# EasyEDA Pro project ProProject_20240815-UR5-手部姿态控制板_2024-09-21.epro

# Schematic Schematic1
Create Date: 2024-08-15; Page Name: P1; Project Name: 20240815-UR5-手部姿态控制板; Schematic Name: Schematic1; Update Date: 2024-08-15; Company: 嘉立创EDA; Page Size: A4; Version: V1.0
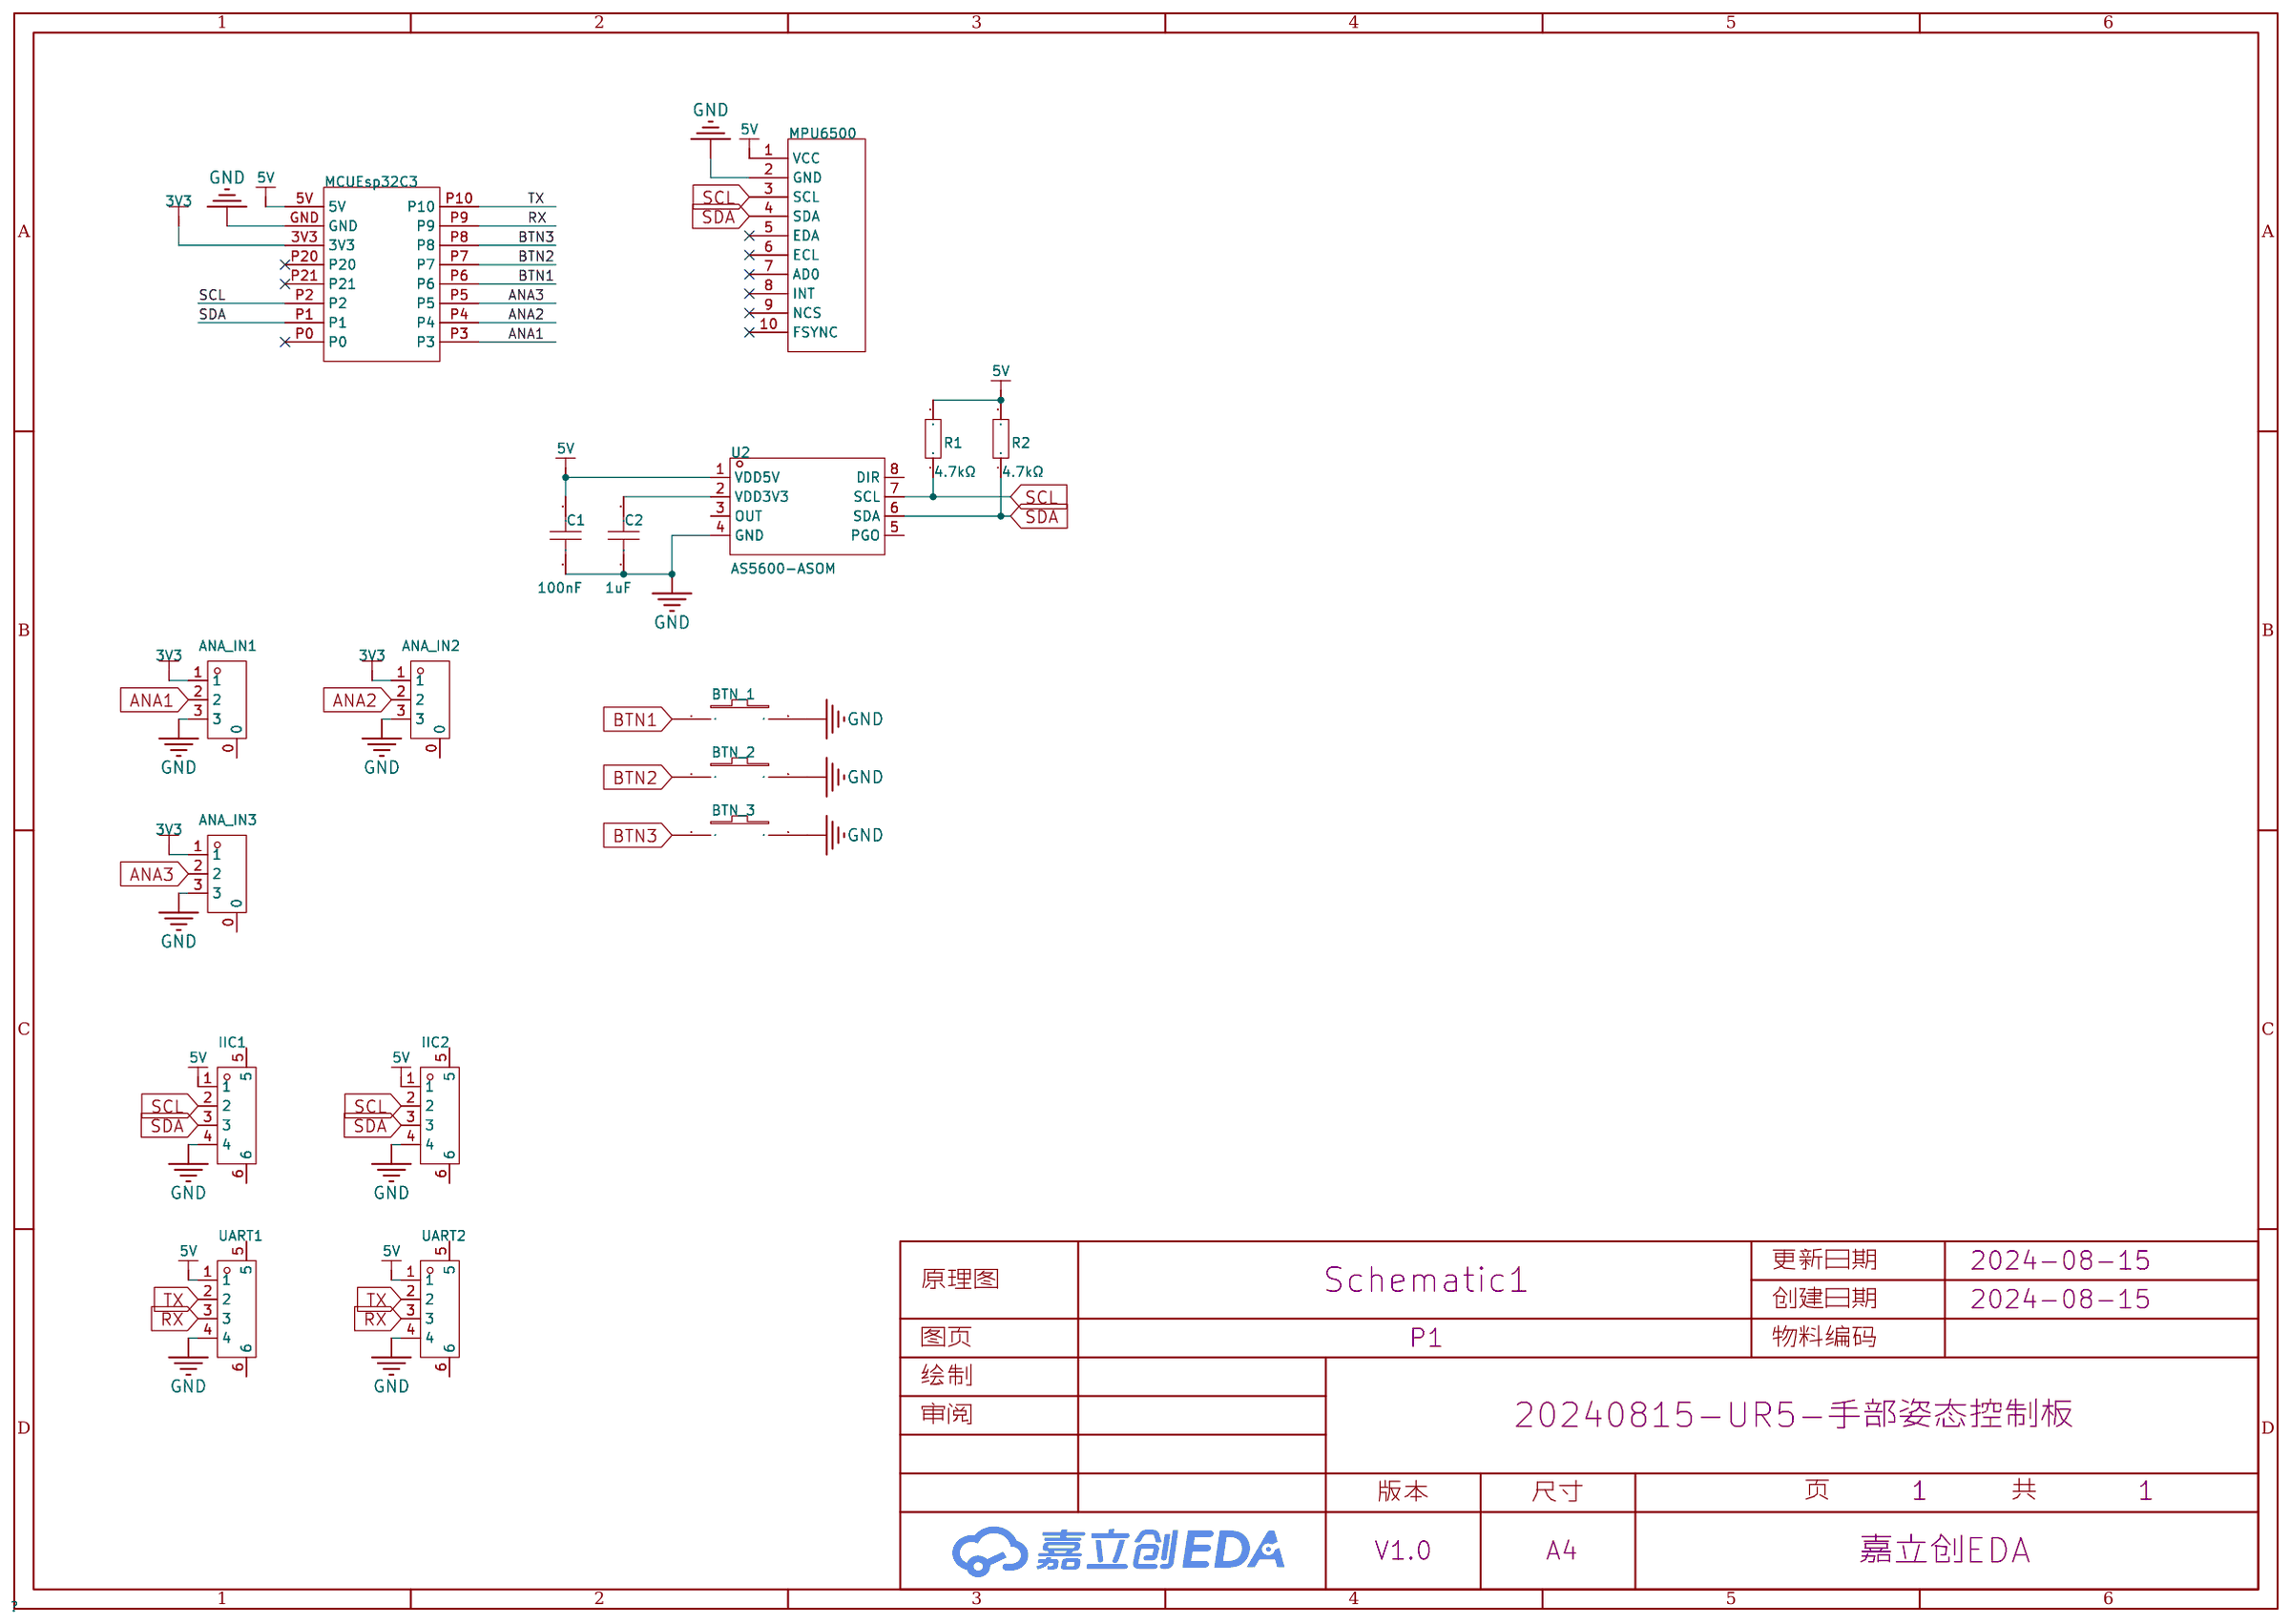
[diagram p0: schematic sheet]

## Parts
ANA_IN1  SH1.0-3P  [CONN-SMD_3P-P1.00-L5.0-W5.0]
ANA_IN2  SH1.0-3P  [CONN-SMD_3P-P1.00-L5.0-W5.0]
ANA_IN3  SH1.0-3P  [CONN-SMD_3P-P1.00-L5.0-W5.0]
BTN_1  K2-1104DZ-B4SW-04  [SW-TH_2P-L6.2-W6.2-P5.0]
BTN_2  K2-1104DZ-B4SW-04  [SW-TH_2P-L6.2-W6.2-P5.0]
BTN_3  K2-1104DZ-B4SW-04  [SW-TH_2P-L6.2-W6.2-P5.0]
C1  1uF  [C1206]
C2  1uF  [C1206]
IIC1  SH1.0 4P  [CONN-SMD_4P-P1.00_C9900013908]
IIC2  SH1.0 4P  [CONN-SMD_4P-P1.00_C9900013908]
MCUEsp32C3  -  [Esp32-C3-mini]
MPU6500  -  [6558模块]
R1  4.7kΩ  [R1206]
R2  4.7kΩ  [R1206]
U2  AS5600-ASOM  [SOIC-8_L5.0-W4.0-P1.27-LS6.0-BL]
UART1  SH1.0 4P  [CONN-SMD_4P-P1.00_C9900013908]
UART2  SH1.0 4P  [CONN-SMD_4P-P1.00_C9900013908]

## Library data of the parts
ANA_IN1-ANA_IN3 = SH1.0-3P: Supplier Part: C9900019066; JLCPCB Part Class: 扩展库; Supplier: LCSC
BTN_1-BTN_3 = K2-1104DZ-B4SW-04: 作用力:250gf;安装方式:直插;开关长度:6mm;开关宽度:6mm;开关高度:4.5mm;触点电流:50mA;额定电压(DC):12V;绝缘电阻:100MΩ;机械寿命:10万次;; LCSC Part Name: 6x6x4.5  两脚插件开关; Supplier Part: C2690025; Manufacturer: 韩国韩荣; Supplier Footprint: 插件; JLCPCB Part Class: 扩展库; Datasheet: https://atta.szlcsc.com/upload/public/pdf/source/20201126/C961736_4F85C6E6E5B3656D5DC7C0B00D034F4A.pdf; Supplier: LCSC; Operating Force: 250gf; Mounting Style: 直插; Switch Length: 6mm; Switch Width: 6mm; Switch Height: 4.5mm; Contact Current: 50mA; Voltage Rating (DC): 12V; Insulation Resistance: 100MΩ; Mechanical Life: 10万次; Operating Temperature: -25℃~+85℃
C1 C2 = CL31B105KBHNNNE: 容值:1uF;精度:±10%;额定电压:50V;材质(温度系数):X7R;; LCSC Part Name: 1uF ±10% 50V; Supplier Part: C1848; Manufacturer: SAMSUNG(三星); Supplier Footprint: 1206; JLCPCB Part Class: 基础库; Datasheet: https://atta.szlcsc.com/upload/public/pdf/source/20160218/1457707763339.pdf; Supplier: LCSC; Tolerance: ±10%; Voltage Rated: 50V; Temperature Coefficient: X7R
IIC1 IIC2 UART1 UART2 = SH1.0 4P: Supplier Part: C9900013908; Supplier Footprint: A100-4; JLCPCB Part Class: 扩展库; Supplier: LCSC
MCUEsp32C3 = Esp32-C3-mini
MPU6500 = MPU6500
R1 R2 = 1206W4F4701T5E: 电阻类型:厚膜电阻;阻值:4.7kΩ;精度:±1%;功率:250mW;最大工作电压:200V;温度系数:±100ppm/℃;; LCSC Part Name: 4.7kΩ ±1% 250mW 厚膜电阻; Supplier Part: C17936; Manufacturer: UNI-ROYAL(厚声); Supplier Footprint: 1206; JLCPCB Part Class: 基础库; Datasheet: https://atta.szlcsc.com/upload/public/pdf/source/20200306/C422600_1E6D84923E4A46A82E41ADD87F860B5C.pdf; Supplier: LCSC; Type: 厚膜电阻; Tolerance: ±1%; Power(Watts): 250mW; Overload Voltage (Max): 200V; Temperature Coefficient: ±100ppm/℃; Operating Temperature Range: -55℃~+155℃
U2 = AS5600-ASOM: 旋转角度范围:0°~360°;; Supplier Part: C79815; Manufacturer: ams(艾迈斯半导体); Supplier Footprint: SOIC-8; JLCPCB Part Class: 扩展库; Datasheet: https://atta.szlcsc.com/upload/public/pdf/source/20161027/1477535527192.pdf; Supplier: LCSC; Supply Voltage: 5V；3.3V; Rotation Angle: 0°~360°

## Nets
3V3: ANA_IN1.1 ANA_IN2.1 ANA_IN3.1 MCUEsp32C3.3V3
5V: C1.2 IIC1.1 IIC2.1 MCUEsp32C3.5V MPU6500.1(VCC) R1.2 R2.2 U2.1(VDD5V) UART1.1 UART2.1
GND: ANA_IN1.3 ANA_IN2.3 ANA_IN3.3 BTN_1.2 BTN_2.2 BTN_3.2 C1.1 C2.1 IIC1.4 IIC2.4 MCUEsp32C3.GND MPU6500.2(GND) U2.4(GND) UART1.4 UART2.4
ANA1: ANA_IN1.2 MCUEsp32C3.P3
ANA2: ANA_IN2.2 MCUEsp32C3.P4
ANA3: ANA_IN3.2 MCUEsp32C3.P5
BTN1: BTN_1.1 MCUEsp32C3.P6
BTN2: BTN_2.1 MCUEsp32C3.P7
BTN3: BTN_3.1 MCUEsp32C3.P8
RX: MCUEsp32C3.P9 UART1.3 UART2.3
SCL: IIC1.2 IIC2.2 MCUEsp32C3.P2 MPU6500.3(SCL) R1.1 U2.7(SCL)
SDA: IIC1.3 IIC2.3 MCUEsp32C3.P1 MPU6500.4(SDA) R2.1 U2.6(SDA)
TX: MCUEsp32C3.P10 UART1.2 UART2.2
$1N1241: C2.2 U2.2(VDD3V3)

Not connected (* = marked no-connect by the designer): ANA_IN1 0; ANA_IN2 0; ANA_IN3 0; IIC1 5 6; IIC2 5 6; MCUEsp32C3 P0* P20* P21*; MPU6500 5(EDA)* 6(ECL)* 7(AD0)* 8(INT)* 9(NCS)* 10(FSYNC)*; U2 3(OUT) 5(PGO) 8(DIR); UART1 5 6; UART2 5 6

# Schematic Schematic1_1
Create Date: 2024-09-01; Page Name: P1; Project Name: 20240815-UR5-手部姿态控制板; Schematic Name: Schematic1_1; Update Date: 2024-09-05; Company: 嘉立创EDA; Page Size: A4; Version: V1.0
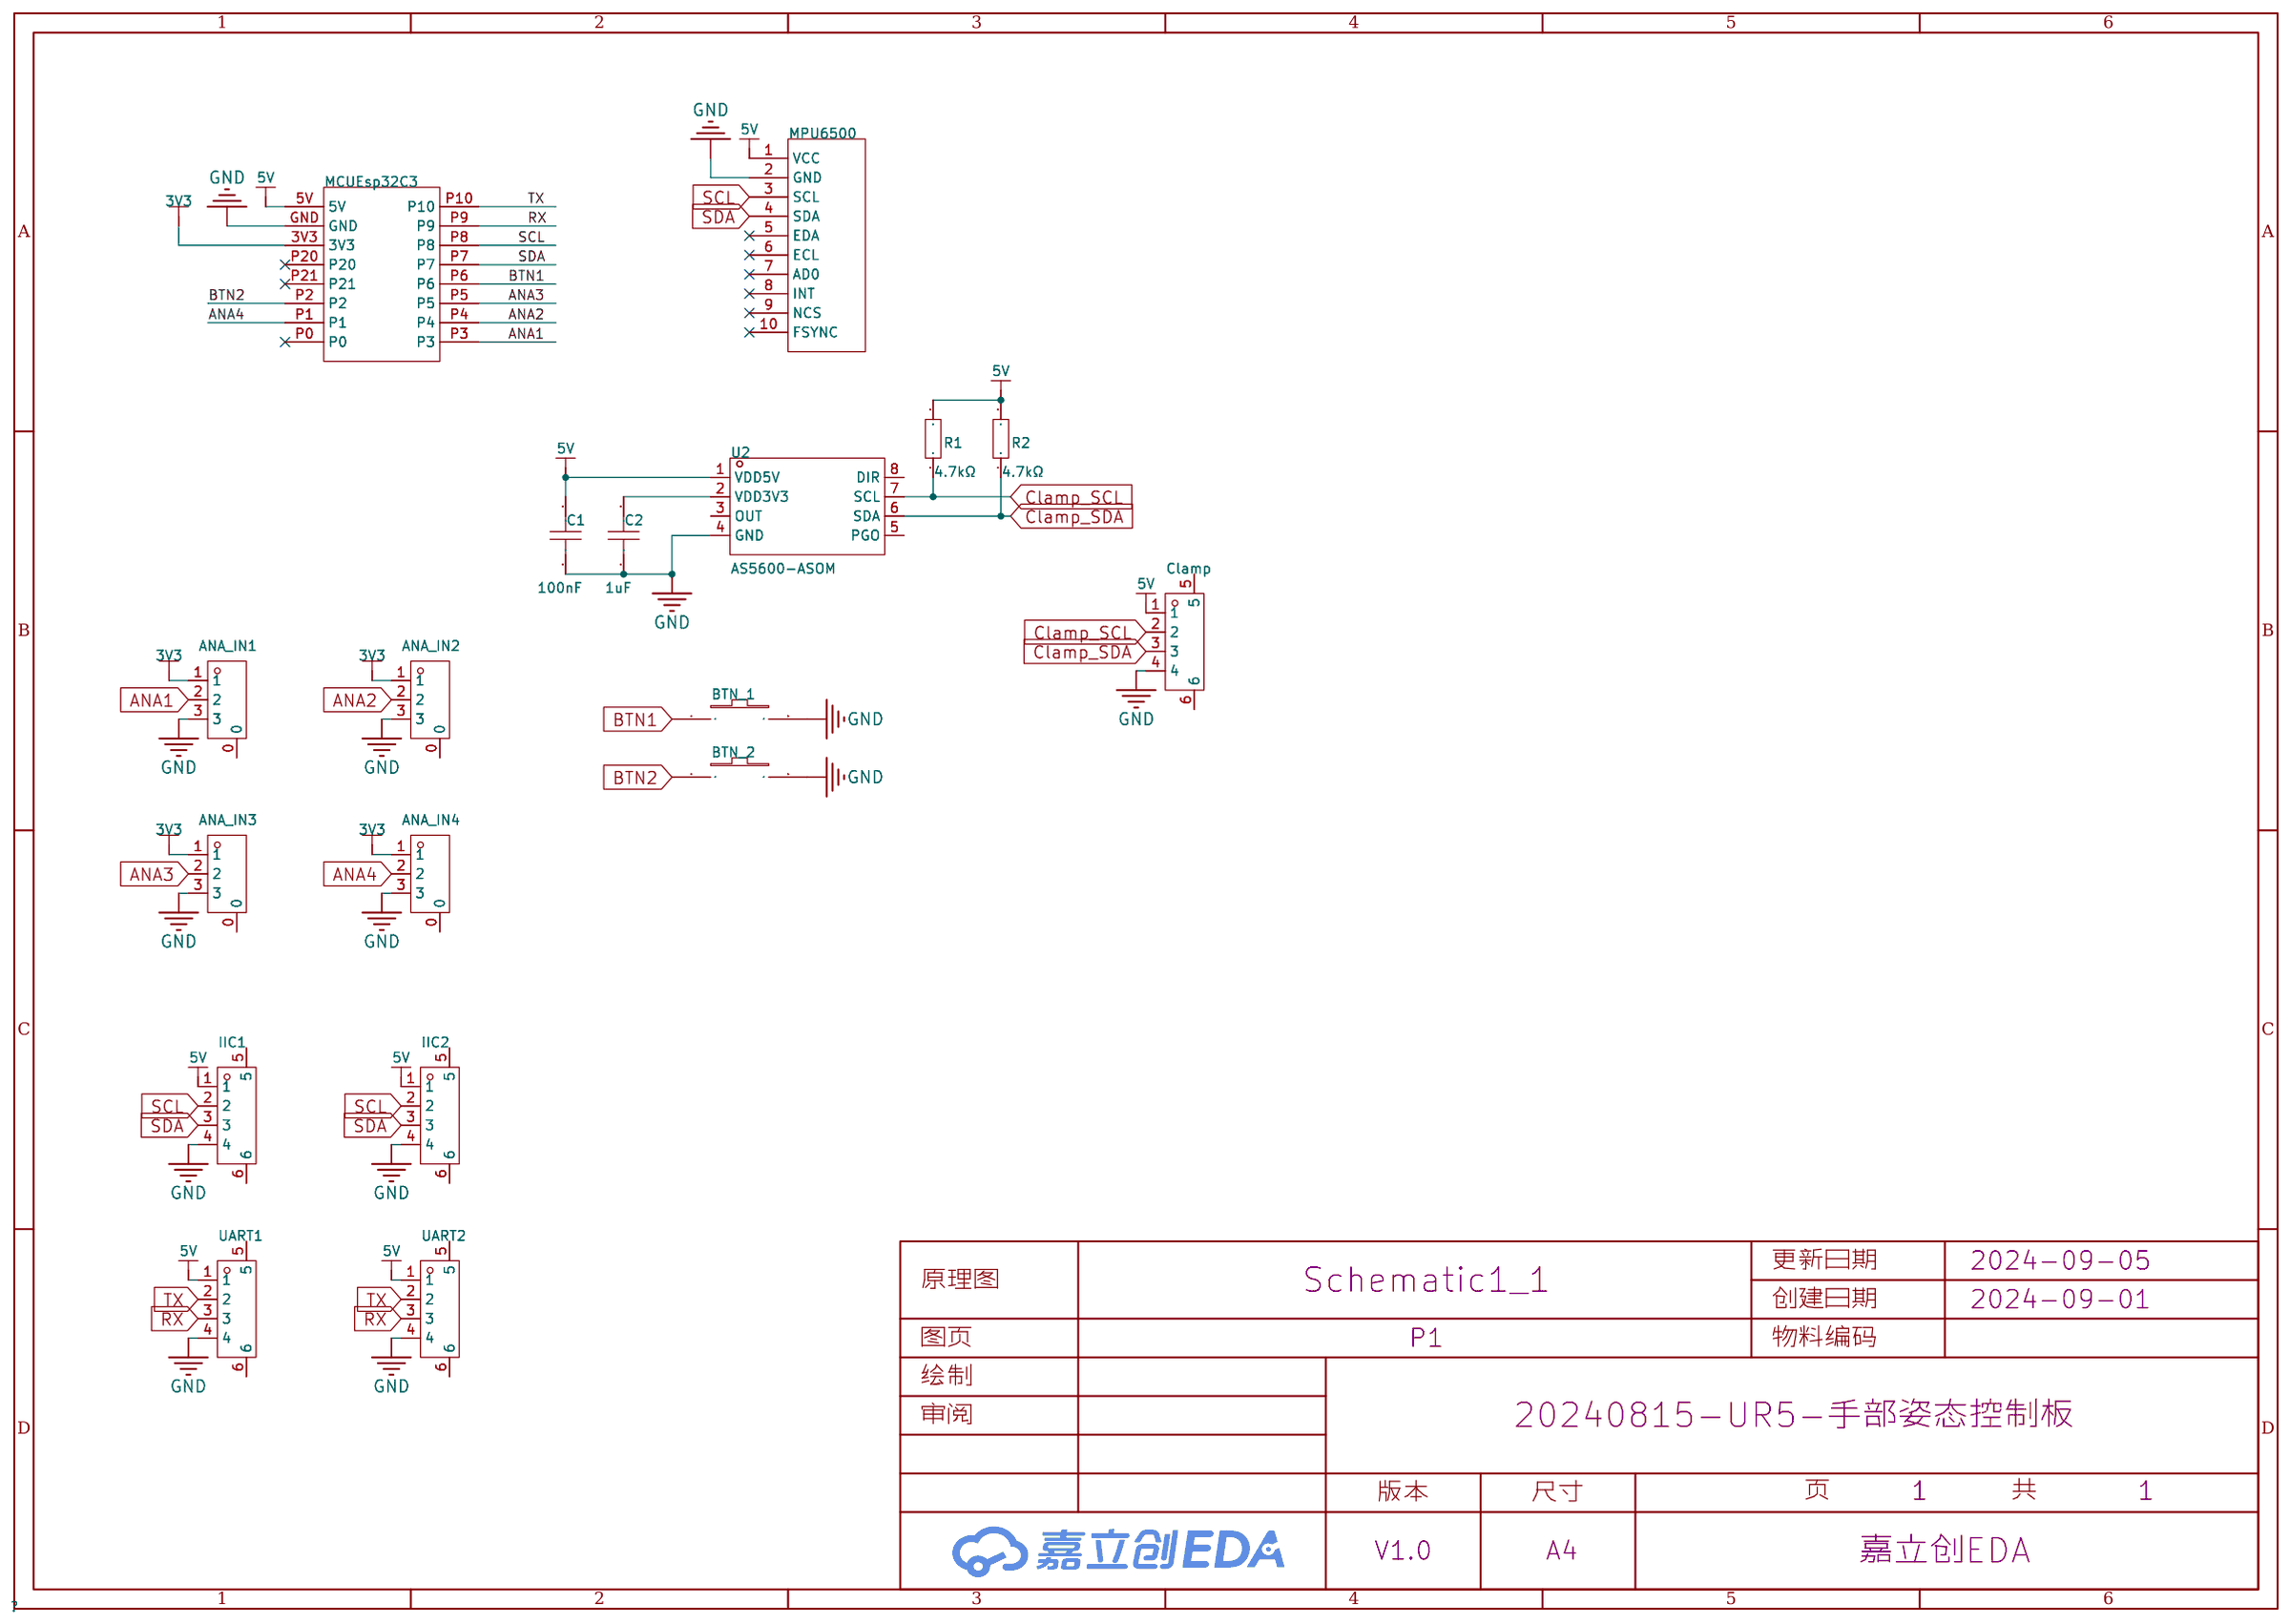
[diagram p1: schematic sheet]

## Parts
ANA_IN1  SH1.0-3P  [CONN-SMD_3P-P1.00-L5.0-W5.0]
ANA_IN2  SH1.0-3P  [CONN-SMD_3P-P1.00-L5.0-W5.0]
ANA_IN3  SH1.0-3P  [CONN-SMD_3P-P1.00-L5.0-W5.0]
ANA_IN4  SH1.0-3P  [CONN-SMD_3P-P1.00-L5.0-W5.0]
BTN_1  K2-1104DZ-B4SW-04  [SW-TH_2P-L6.2-W6.2-P5.0]
BTN_2  K2-1104DZ-B4SW-04  [SW-TH_2P-L6.2-W6.2-P5.0]
C1  1uF  [C1206]
C2  1uF  [C1206]
Clamp  SH1.0 4P  [CONN-SMD_4P-P1.00_C9900013908]
IIC1  SH1.0 4P  [CONN-SMD_4P-P1.00_C9900013908]
IIC2  SH1.0 4P  [CONN-SMD_4P-P1.00_C9900013908]
MCUEsp32C3  -  [Esp32-C3-mini]
MPU6500  -  [6558模块]
R1  4.7kΩ  [R1206]
R2  4.7kΩ  [R1206]
U2  AS5600-ASOM  [SOIC-8_L5.0-W4.0-P1.27-LS6.0-BL]
UART1  SH1.0 4P  [CONN-SMD_4P-P1.00_C9900013908]
UART2  SH1.0 4P  [CONN-SMD_4P-P1.00_C9900013908]

## Library data of the parts
ANA_IN1-ANA_IN4 = SH1.0-3P: Supplier Part: C9900019066; JLCPCB Part Class: 扩展库; Supplier: LCSC
BTN_1 BTN_2 = K2-1104DZ-B4SW-04: 作用力:250gf;安装方式:直插;开关长度:6mm;开关宽度:6mm;开关高度:4.5mm;触点电流:50mA;额定电压(DC):12V;绝缘电阻:100MΩ;机械寿命:10万次;; LCSC Part Name: 6x6x4.5  两脚插件开关; Supplier Part: C2690025; Manufacturer: 韩国韩荣; Supplier Footprint: 插件; JLCPCB Part Class: 扩展库; Datasheet: https://atta.szlcsc.com/upload/public/pdf/source/20201126/C961736_4F85C6E6E5B3656D5DC7C0B00D034F4A.pdf; Supplier: LCSC; Operating Force: 250gf; Mounting Style: 直插; Switch Length: 6mm; Switch Width: 6mm; Switch Height: 4.5mm; Contact Current: 50mA; Voltage Rating (DC): 12V; Insulation Resistance: 100MΩ; Mechanical Life: 10万次; Operating Temperature: -25℃~+85℃
C1 C2 = CL31B105KBHNNNE: 容值:1uF;精度:±10%;额定电压:50V;材质(温度系数):X7R;; LCSC Part Name: 1uF ±10% 50V; Supplier Part: C1848; Manufacturer: SAMSUNG(三星); Supplier Footprint: 1206; JLCPCB Part Class: 基础库; Datasheet: https://atta.szlcsc.com/upload/public/pdf/source/20160218/1457707763339.pdf; Supplier: LCSC; Tolerance: ±10%; Voltage Rated: 50V; Temperature Coefficient: X7R
Clamp IIC1 IIC2 UART1 UART2 = SH1.0 4P: Supplier Part: C9900013908; Supplier Footprint: A100-4; JLCPCB Part Class: 扩展库; Supplier: LCSC
MCUEsp32C3 = Esp32-C3-mini
MPU6500 = MPU6500
R1 R2 = 1206W4F4701T5E: 电阻类型:厚膜电阻;阻值:4.7kΩ;精度:±1%;功率:250mW;最大工作电压:200V;温度系数:±100ppm/℃;; LCSC Part Name: 4.7kΩ ±1% 250mW 厚膜电阻; Supplier Part: C17936; Manufacturer: UNI-ROYAL(厚声); Supplier Footprint: 1206; JLCPCB Part Class: 基础库; Datasheet: https://atta.szlcsc.com/upload/public/pdf/source/20200306/C422600_1E6D84923E4A46A82E41ADD87F860B5C.pdf; Supplier: LCSC; Type: 厚膜电阻; Tolerance: ±1%; Power(Watts): 250mW; Overload Voltage (Max): 200V; Temperature Coefficient: ±100ppm/℃; Operating Temperature Range: -55℃~+155℃
U2 = AS5600-ASOM: 旋转角度范围:0°~360°;; Supplier Part: C79815; Manufacturer: ams(艾迈斯半导体); Supplier Footprint: SOIC-8; JLCPCB Part Class: 扩展库; Datasheet: https://atta.szlcsc.com/upload/public/pdf/source/20161027/1477535527192.pdf; Supplier: LCSC; Supply Voltage: 5V；3.3V; Rotation Angle: 0°~360°

## Nets
3V3: ANA_IN1.1 ANA_IN2.1 ANA_IN3.1 ANA_IN4.1 MCUEsp32C3.3V3
5V: C1.2 Clamp.1 IIC1.1 IIC2.1 MCUEsp32C3.5V MPU6500.1(VCC) R1.2 R2.2 U2.1(VDD5V) UART1.1 UART2.1
GND: ANA_IN1.3 ANA_IN2.3 ANA_IN3.3 ANA_IN4.3 BTN_1.2 BTN_2.2 C1.1 C2.1 Clamp.4 IIC1.4 IIC2.4 MCUEsp32C3.GND MPU6500.2(GND) U2.4(GND) UART1.4 UART2.4
ANA1: ANA_IN1.2 MCUEsp32C3.P3
ANA2: ANA_IN2.2 MCUEsp32C3.P4
ANA3: ANA_IN3.2 MCUEsp32C3.P5
ANA4: ANA_IN4.2 MCUEsp32C3.P1
BTN1: BTN_1.1 MCUEsp32C3.P6
BTN2: BTN_2.1 MCUEsp32C3.P2
Clamp_SCL: Clamp.2 R1.1 U2.7(SCL)
Clamp_SDA: Clamp.3 R2.1 U2.6(SDA)
RX: MCUEsp32C3.P9 UART1.3 UART2.3
SCL: IIC1.2 IIC2.2 MCUEsp32C3.P8 MPU6500.3(SCL)
SDA: IIC1.3 IIC2.3 MCUEsp32C3.P7 MPU6500.4(SDA)
TX: MCUEsp32C3.P10 UART1.2 UART2.2
$1N1241: C2.2 U2.2(VDD3V3)

Not connected (* = marked no-connect by the designer): ANA_IN1 0; ANA_IN2 0; ANA_IN3 0; ANA_IN4 0; Clamp 5 6; IIC1 5 6; IIC2 5 6; MCUEsp32C3 P0* P20* P21*; MPU6500 5(EDA)* 6(ECL)* 7(AD0)* 8(INT)* 9(NCS)* 10(FSYNC)*; U2 3(OUT) 5(PGO) 8(DIR); UART1 5 6; UART2 5 6

# Board PCB1
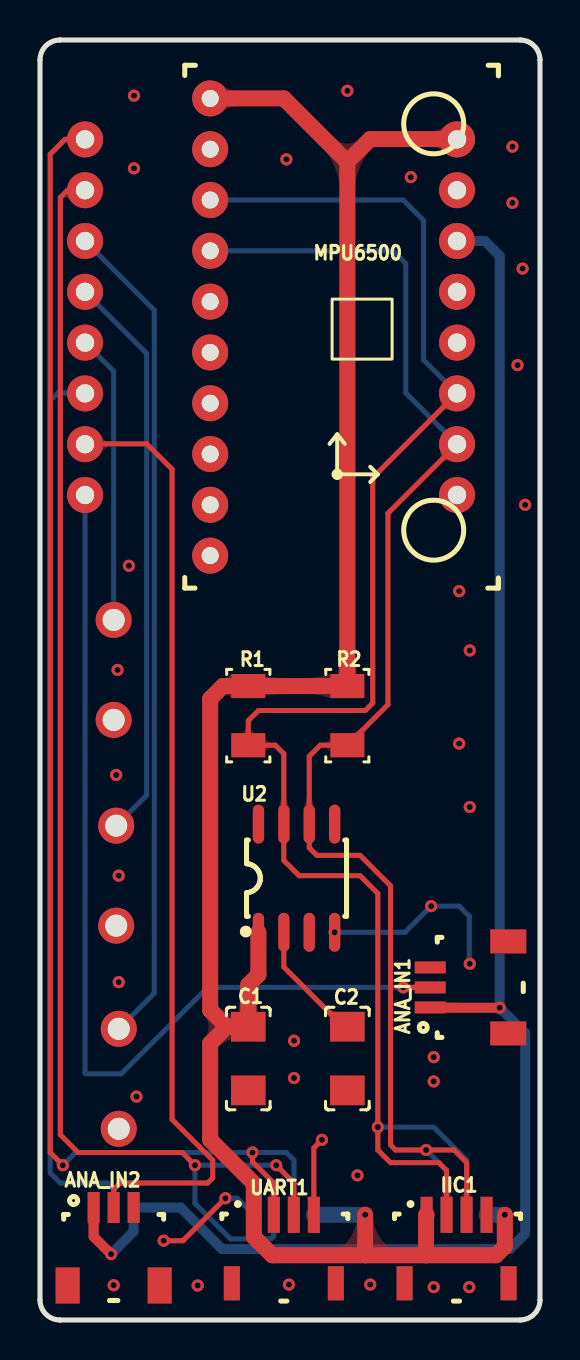
[diagram p2: board, top side]
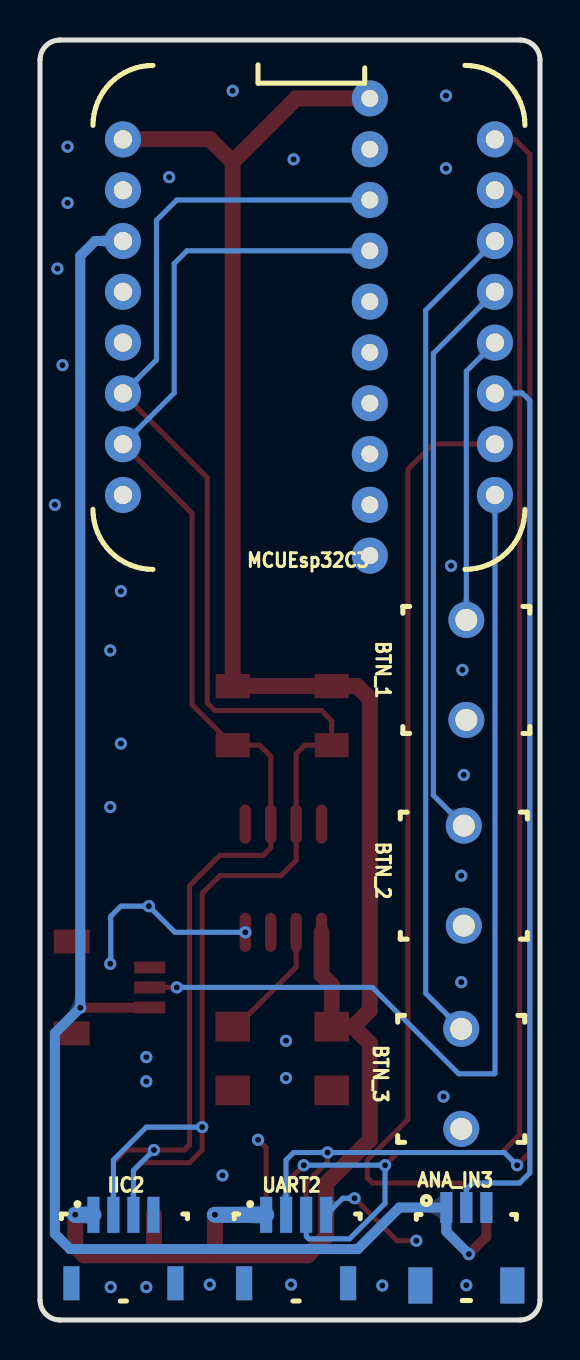
[diagram p3: board, bottom side, seen from below]

Outline 25 x 64 mm; copper layers: Top Layer, Bottom Layer. Coordinates in mm from the lower left corner of the outline.
Outline path: 0,63 0,1 arc(0.29,0.29) 1,0 24,0 arc(24.71,0.29) 25,1 25,63 arc(24.71,63.71) 24,64 1,64 arc(0.29,63.71) 0,63
Stack: Top Layer 0.035mm / Dielectric1 1.51mm FR4 er 4.5 / Bottom Layer 0.035mm

## Design rules (mm)
template: JLCPCB Capability(Two Layers Board)
spacing copperThickness1oz (default): track to track 0.102, other pairs 0.152 to 0.3
spacing copperThickness2oz: track to track 0.203, other pairs 0.152 to 0.3
track width copperThickness1oz (default): min 0.127, default 0.254, max 2.54
track width copperThickness2oz: min 0.203, default 0.254, max 2.54
differential pair differentialPair (default): width min 0.127, default 0.254, max 2.54; gap min 0.152, default 0.152
via viaSize (default): diameter min 0.5, default 0.61, max 10; hole min 0.3, default 0.305, max 6.3

## Placement (name value [footprint] x y rotation side)
ANA_IN1  SH1.0-3P  [CONN-SMD_3P-P1.00-L5.0-W5.0]  21.46 16.63 90 top
ANA_IN2  SH1.0-3P  [CONN-SMD_3P-P1.00-L5.0-W5.0]  3.68 3.68 0 top
ANA_IN3  SH1.0-3P  [CONN-SMD_3P-P1.00-L5.0-W5.0]  3.68 3.68 180 bottom
BTN_1  K2-1104DZ-B4SW-04  [SW-TH_2P-L6.2-W6.2-P5.0]  3.68 32.5 270 bottom
BTN_2  K2-1104DZ-B4SW-04  [SW-TH_2P-L6.2-W6.2-P5.0]  3.81 22.22 270 bottom
BTN_3  K2-1104DZ-B4SW-04  [SW-TH_2P-L6.2-W6.2-P5.0]  3.94 12.06 270 bottom
C1  1uF  [C1206]  10.41 13.07 90 top
C2  1uF  [C1206]  15.37 13.07 90 top
IIC1  SH1.0 4P  [CONN-SMD_4P-P1.00_C9900013908]  20.83 3.55 0 top
IIC2  SH1.0 4P  [CONN-SMD_4P-P1.00_C9900013908]  20.83 3.55 180 bottom
MCUEsp32C3  -  [Esp32-C3-mini]  22.35 62.73 180 bottom
MPU6500  -  [6558模块]  8.51 50.92 0 top
R1  4.7kΩ  [R1206]  10.41 30.22 90 top
R2  4.7kΩ  [R1206]  15.37 30.22 90 top
U2  AS5600-ASOM  [SOIC-8_L5.0-W4.0-P1.27-LS6.0-BL]  12.83 22.09 0 top
UART1  SH1.0 4P  [CONN-SMD_4P-P1.00_C9900013908]  12.19 3.55 0 top
UART2  SH1.0 4P  [CONN-SMD_4P-P1.00_C9900013908]  12.19 3.55 180 bottom

## Footprints (pads in the part's own frame, mm; a bottom-side part is the same pattern mirrored in y, then rotated)
6558模块
  round 1.8 hole 0.85: 1(0,10.16) 2(0,7.62) 3(0,5.08) 4(0,2.54) 5(0,0) 6(0,-2.54) 7(0,-5.08) 8(0,-7.62) 9(0,-10.16) 10(0,-12.7)
C1206
  rect 1.485x1.728 smd: 1(-1.593,0) 2(1.593,0)
CONN-SMD_3P-P1.00-L5.0-W5.0
  rect 1.2x1.8 smd: 0(-2.3,-1.95) 0(2.3,-1.95)
  rect 0.6x1.55 smd: 1(-1,1.95) 2(0,1.95) 3(1,1.95)
CONN-SMD_4P-P1.00_C9900013908
  rect 0.6x1.8 smd: 1(-1.5,1.712) 2(-0.5,1.712) 3(0.5,1.712) 4(1.5,1.712)
  rect 0.8x1.7 smd: 5(2.6,-1.712) 6(-2.6,-1.712)
Esp32-C3-mini
  round 1.8 hole 0.914x0.85: 3V3(1.5,-8.78) 5V(1.5,-3.7) GND(1.5,-6.24) P0(1.5,-21.48) P1(1.5,-18.94) P2(1.5,-16.4) P3(20.1,-21.48) P4(20.1,-18.94) P5(20.1,-16.4) P6(20.1,-13.86) P7(20.1,-11.32) P8(20.1,-8.78) P9(20.1,-6.24) P10(20.1,-3.7) P20(1.5,-11.32) P21(1.5,-13.86)
R1206
  rect 1.208x1.701 smd: 1(-1.479,0) 2(1.479,0)
SOIC-8_L5.0-W4.0-P1.27-LS6.0-BL
  oval 0.569x1.95 smd: 1(-1.905,-2.705) 2(-0.635,-2.705) 3(0.635,-2.705) 4(1.905,-2.705) 5(1.905,2.705) 6(0.635,2.705) 7(-0.635,2.705) 8(-1.905,2.705)
SW-TH_2P-L6.2-W6.2-P5.0
  round 1.8 hole 1.1x0.85: 1(-2.5,0) 2(2.5,0)

## Nets
As in the schematic.

Pads without a net: ANA_IN1 0; ANA_IN2 0; ANA_IN3 0; IIC1 5 6; IIC2 5 6; MCUEsp32C3 P0 P20 P21; MPU6500 5 6 7 8 9 10; U2 3 5 8; UART1 5 6; UART2 5 6

## Via types
v1: diameter 0.61, hole 0.305, Top Layer to Bottom Layer, 48 vias

## Routing (per net, layer and track width the routed paths; a pad name or vN(x,y) marks a point on that pad's centre or on a via; arc(x,y) is an arc through that point)
3V3: length 81.6
  Top Layer w0.5: v1(22.99,15.61) 19.53,15.61 ANA_IN1.1 ; ANA_IN2.1 2.68,4.17 v1(3.56,3.29)
  Bottom Layer w0.5: MCUEsp32C3.3V3 22.24,53.95 22.99,53.2 v1(22.99,15.61) 24.26,14.34 24.26,4.31 23.5,3.55 9.11,3.55 7.03,5.62 ANA_IN3.1 4.68,4.42 v1(3.56,3.29)
5V: length 104.2
  Top Layer w0.8: 16.26,3.24 11.61,3.24 10.69,4.16 UART1.1 10.69,6.83 8.51,9.01 8.51,13.83 9.34,14.67 ; 16.26,3.24 v1(16.26,5.26) ; 16.26,3.24 19.3,3.24 ; U2.1 10.92,17.26 10.41,16.76 C1.2 9.34,14.67 ; v1(23.24,5.26) 23.24,3.68 22.8,3.24 19.3,3.24 ; 9.34,14.67 8.51,15.5 8.51,31.06 9.14,31.7 R1.2 R2.2 15.37,57.9 ; 15.37,57.9 12.19,61.08 MPU6500.1 ; 15.37,57.9 16.51,59.05 20.84,59.05 MCUEsp32C3.5V ; 19.3,3.24 19.3,5.24 IIC1.1
  Bottom Layer w0.8: IIC2.1 v1(23.24,5.26) ; UART2.1 v1(16.26,5.26)
GND: length 19.5
  Top Layer w0.254: v1(9.27,6.09) 7.15,3.96 v1(6.18,3.96) ; UART1.4 13.69,8.6 v1(14.1,9.01)
  Bottom Layer w0.254: v1(14.73,19.39) 18.25,19.39 v1(19.56,20.69) 20.96,20.69 21.46,20.19 21.46,17.83 v1(21.49,17.81) ; UART2.4 9.86,6.09 v1(9.27,6.09)
  vias: v1(3.68,1.74) v1(3.81,27.25) v1(3.88,32.5) v1(3.94,22.22) v1(3.94,16.89) v1(4.44,37.71) v1(4.7,61.22) v1(4.7,57.58) v1(4.83,11.17) v1(7.88,1.72) v1(12.32,58.03) v1(12.45,1.77) v1(12.7,13.96) v1(12.7,12.1) v1(15.37,61.46) v1(15.88,7.23) v1(16.51,1.77) v1(18.54,57.14) v1(19.69,13.14) v1(19.69,11.93) v1(19.69,1.64) v1(20.96,36.44) v1(20.96,28.82) v1(21.49,33.48) v1(21.49,25.65) v1(21.46,1.64) v1(23.62,58.67) v1(23.62,55.86) v1(23.88,47.74) v1(24.13,52.57) v1(24.26,40.76)
ANA1: length 48
  Top Layer w0.254: ANA_IN1.2 v1(18.16,16.63)
  Bottom Layer w0.254: v1(18.16,16.63) 8.38,16.63 4.06,12.31 2.29,12.31 2.25,12.34 MCUEsp32C3.P3
ANA2: length 47.3
  Top Layer w0.254: ANA_IN2.2 3.68,6.53 4.01,6.85 8.38,6.85 8.64,7.1 8.64,7.99 6.6,10.02 6.6,42.54 5.33,43.81 2.27,43.81 MCUEsp32C3.P4
ANA3: length 44.9
  Bottom Layer w0.254: MCUEsp32C3.P5 2.24,46.35 0.89,46.35 0.51,45.97 0.51,7.36 1.02,6.85 3.36,6.85 3.68,6.53 ANA_IN3.2
BTN1: length 14.5
  Bottom Layer w0.254: BTN_1.1 3.68,47.44 MCUEsp32C3.P6
BTN2: length 28.6
  Bottom Layer w0.254: MCUEsp32C3.P7 5.33,48.33 5.33,26.24 BTN_2.1
BTN3: length 41.6
  Bottom Layer w0.254: MCUEsp32C3.P8 5.72,50.49 5.72,16.33 BTN_3.1
RX: length 70.2
  Top Layer w0.254: v1(7.75,7.74) 7.11,8.37 1.91,8.37 1.02,9.26 1.02,56.13 1.38,56.49 MCUEsp32C3.P9 ; v1(11.81,7.74) 12.69,6.86 UART1.3
  Bottom Layer w0.254: v1(11.81,7.74) v1(7.75,7.74) 7.75,5.83 9.53,4.06 11.56,4.06 11.68,4.18 11.68,5.25 UART2.3
SCL: length 84.9
  Top Layer w0.254: IIC1.2 20.32,5.27 20.32,7.48 19.94,7.87 17.53,7.87 16.89,8.5 v1(16.89,9.64) 16.89,21.33 16,22.22 12.95,22.22 12.19,22.98 U2.7 12.19,28.31 11.77,28.74 R1.1 10.41,29.96 10.92,30.47 16.26,30.47 16.64,30.85 16.64,42.11 MCUEsp32C3.P2
  Bottom Layer w0.254: v1(16.89,9.64) 19.69,9.64 21.33,8 IIC2.2 ; MPU6500.3 18.16,56 19.18,54.98 19.18,48 MCUEsp32C3.P2
SDA: length 72.4
  Top Layer w0.254: MCUEsp32C3.P1 17.4,40.34 17.4,30.77 R2.1 14.01,28.74 13.46,28.19 U2.6 13.46,23.61 13.84,23.23 16,23.23 17.53,21.71 17.53,8.75 17.78,8.5 v1(19.3,8.5) 20.7,8.5 21.34,7.87 21.34,5.27 IIC1.3
  Bottom Layer w0.254: IIC2.3 20.33,7.48 v1(19.3,8.5) ; MCUEsp32C3.P1 18.29,46.35 18.29,52.82 17.65,53.46 MPU6500.4
TX: length 71.1
  Top Layer w0.254: UART1.2 11.69,6.84 10.62,7.91 v1(10.62,8.37) ; MCUEsp32C3.P10 1.25,59.03 0.51,58.28 0.51,8.37 v1(1.14,7.74)
  Bottom Layer w0.254: v1(1.14,7.74) 1.78,8.37 v1(10.62,8.37) 12.32,8.37 12.7,7.99 12.7,5.27 UART2.2
$1N1241: length 6.1
  Top Layer w0.254: U2.2 12.19,17.64 15.17,14.67 C2.2

## Copper pours and planes (outline as drawn; the poured copper is in the pictures)
GND on Top Layer: -2.03,65.4 26.54,65.4 26.54,-3.31 -2.03,-3.31
GND on Bottom Layer: -4.83,66.03 29.46,66.03 29.46,-3.56 -4.83,-3.56

Small or netless copper shapes (teardrops, artwork), in the pictures only: 47 on Top Layer, 37 on Bottom Layer

# Board PCB1_1
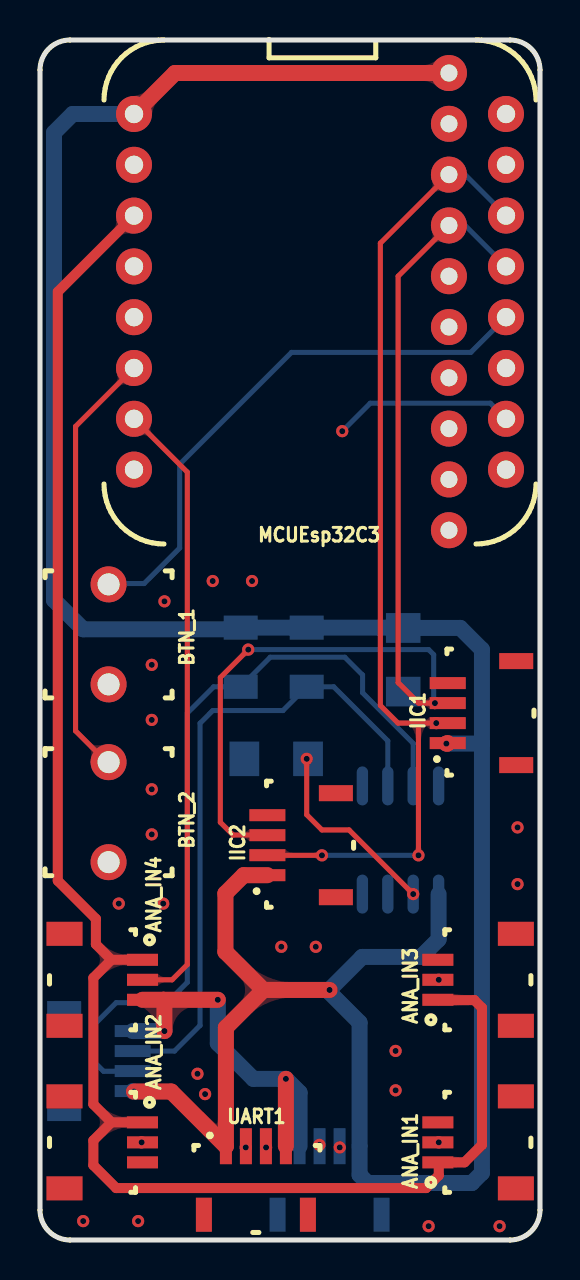
[diagram p4: board, top side]
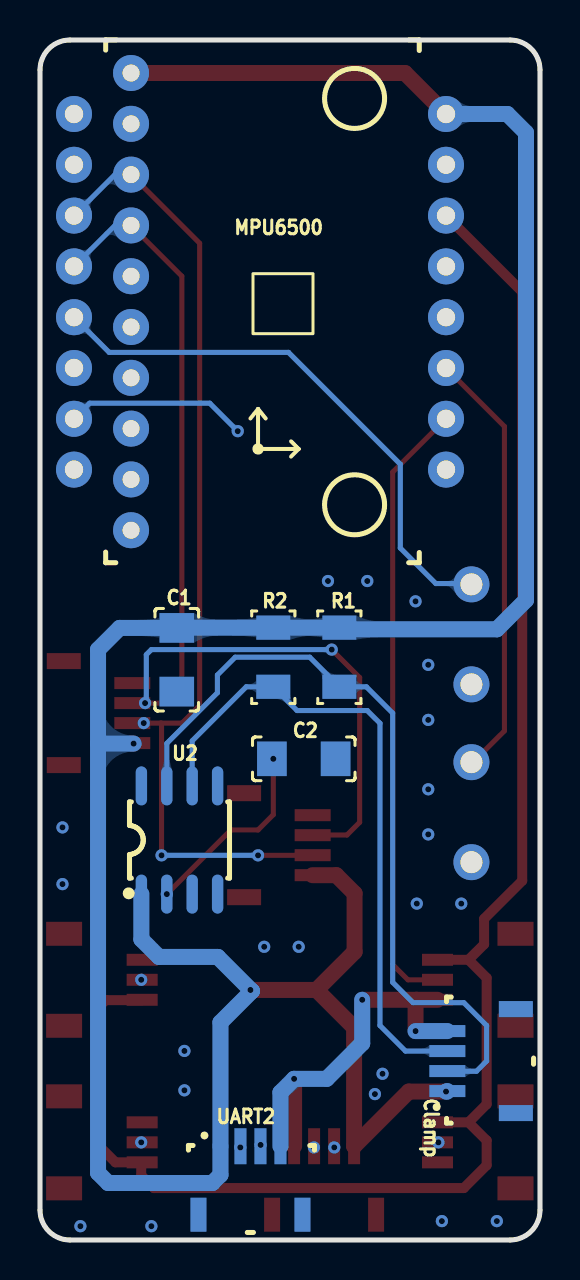
[diagram p5: board, bottom side, seen from below]

Outline 25 x 60 mm; copper layers: Top Layer, Inner1, Inner2, Bottom Layer. Coordinates in mm from the lower left corner of the outline.
Outline path: 0,58.5 0,1.5 arc(0.44,0.44) 1.5,0 23.5,0 arc(24.56,0.44) 25,1.5 25,58.5 arc(24.56,59.56) 23.5,60 1.5,60 arc(0.44,59.56) 0,58.5
Stack: Top Layer 0.035mm 外层铜厚1oz / Dielectric1 0.2104mm 7628 RC49% 8.6mil / Inner1 0.0152mm 内层铜厚 / Dielectric2 1.065mm 1.1mm H/HOZ 含铜 / Inner2 0.0152mm 内层铜厚 / Dielectric3 0.2104mm 7628 RC49% 8.6mil / Bottom Layer 0.035mm 外层铜厚1oz

## Design rules (mm)
template: JLCPCB Capability(Two Layers Board)
spacing copperThickness1oz (default): track to track 0.102, other pairs 0.152 to 0.3
spacing copperThickness2oz: track to track 0.203, other pairs 0.152 to 0.3
track width copperThickness1oz (default): min 0.127, default 0.254, max 2.54
track width copperThickness2oz: min 0.203, default 0.254, max 2.54
differential pair differentialPair (default): width min 0.127, default 0.254, max 2.54; gap min 0.152, default 0.152
via viaSize (default): diameter min 0.5, default 0.61, max 10; hole min 0.3, default 0.305, max 6.3

## Placement (name value [footprint] x y rotation side)
ANA_IN1  SH1.0-3P  [CONN-SMD_3P-P1.00-L5.0-W5.0]  21.84 4.88 90 top
ANA_IN2  SH1.0-3P  [CONN-SMD_3P-P1.00-L5.0-W5.0]  3.18 4.88 270 top
ANA_IN3  SH1.0-3P  [CONN-SMD_3P-P1.00-L5.0-W5.0]  21.84 13.01 90 top
ANA_IN4  SH1.0-3P  [CONN-SMD_3P-P1.00-L5.0-W5.0]  3.18 13.01 270 top
BTN_1  K2-1104DZ-B4SW-04  [SW-TH_2P-L6.2-W6.2-P5.0]  3.43 30.28 270 top
BTN_2  K2-1104DZ-B4SW-04  [SW-TH_2P-L6.2-W6.2-P5.0]  3.43 21.39 270 top
C1  1uF  [C1206]  18.16 29.01 90 bottom
C2  1uF  [C1206]  11.81 24.06 0 bottom
Clamp  SH1.0 4P  [CONN-SMD_4P-P1.00_C9900013908]  2.92 8.95 90 bottom
IIC1  SH1.0 4P  [CONN-SMD_4P-P1.00_C9900013908]  22.1 26.34 90 top
IIC2  SH1.0 4P  [CONN-SMD_4P-P1.00_C9900013908]  13.08 19.74 90 top
MCUEsp32C3  -  [Esp32-C3-mini]  3.2 60 0 top
MPU6500  -  [6558模块]  20.45 48.19 180 bottom
R1  4.7kΩ  [R1206]  10.03 29.14 90 bottom
R2  4.7kΩ  [R1206]  13.34 29.14 90 bottom
U2  AS5600-ASOM  [SOIC-8_L5.0-W4.0-P1.27-LS6.0-BL]  18.03 20 180 bottom
UART1  SH1.0 4P  [CONN-SMD_4P-P1.00_C9900013908]  10.79 2.98 0 top
UART2  SH1.0 4P  [CONN-SMD_4P-P1.00_C9900013908]  14.48 2.98 180 bottom

## Footprints (pads in the part's own frame, mm; a bottom-side part is the same pattern mirrored in y, then rotated)
6558模块
  round 1.8 hole 0.85: 1(0,10.16) 2(0,7.62) 3(0,5.08) 4(0,2.54) 5(0,0) 6(0,-2.54) 7(0,-5.08) 8(0,-7.62) 9(0,-10.16) 10(0,-12.7)
C1206
  rect 1.485x1.728 smd: 1(-1.593,0) 2(1.593,0)
CONN-SMD_3P-P1.00-L5.0-W5.0
  rect 1.2x1.8 smd: 0(-2.3,-1.95) 0(2.3,-1.95)
  rect 0.6x1.55 smd: 1(-1,1.95) 2(0,1.95) 3(1,1.95)
CONN-SMD_4P-P1.00_C9900013908
  rect 0.6x1.8 smd: 1(-1.5,1.712) 2(-0.5,1.712) 3(0.5,1.712) 4(1.5,1.712)
  rect 0.8x1.7 smd: 5(2.6,-1.712) 6(-2.6,-1.712)
Esp32-C3-mini
  round 1.8 hole 0.914x0.85: 3V3(1.5,-8.78) 5V(1.5,-3.7) GND(1.5,-6.24) P0(1.5,-21.48) P1(1.5,-18.94) P2(1.5,-16.4) P3(20.1,-21.48) P4(20.1,-18.94) P5(20.1,-16.4) P6(20.1,-13.86) P7(20.1,-11.32) P8(20.1,-8.78) P9(20.1,-6.24) P10(20.1,-3.7) P20(1.5,-11.32) P21(1.5,-13.86)
R1206
  rect 1.208x1.701 smd: 1(-1.479,0) 2(1.479,0)
SOIC-8_L5.0-W4.0-P1.27-LS6.0-BL
  oval 0.569x1.95 smd: 1(-1.905,-2.705) 2(-0.635,-2.705) 3(0.635,-2.705) 4(1.905,-2.705) 5(1.905,2.705) 6(0.635,2.705) 7(-0.635,2.705) 8(-1.905,2.705)
SW-TH_2P-L6.2-W6.2-P5.0
  round 1.8 hole 1.1x0.85: 1(-2.5,0) 2(2.5,0)

## Nets
As in the schematic, except:
CLAMP_SCL: Clamp.2 R1.1 U2.7
CLAMP_SDA: Clamp.3 R2.1 U2.6

Pads without a net: ANA_IN1 0; ANA_IN2 0; ANA_IN3 0; ANA_IN4 0; Clamp 5 6; IIC1 5 6; IIC2 5 6; MCUEsp32C3 P0 P20 P21; MPU6500 5 6 7 8 9 10; U2 3 5 8; UART1 5 6; UART2 5 6

## Via types
v1: diameter 0.61, hole 0.305, Top Layer to Bottom Layer, 42 vias

## Routing (per net, layer and track width the routed paths; a pad name or vN(x,y) marks a point on that pad's centre or on a via; arc(x,y) is an arc through that point)
3V3: length 84.9
  Top Layer w0.5: MCUEsp32C3.3V3 0.89,47.41 0.89,17.96 2.79,16.06 2.79,14.79 3.57,14.01 ; 3.57,5.88 2.67,6.79 2.67,13.11 3.57,14.01 ; 3.57,5.88 2.67,4.98 2.67,3.74 3.81,2.6 19.3,2.6 19.94,3.23 19.94,3.84 ANA_IN1.1 21.22,3.88 22.1,4.75 22.1,11.61 21.72,11.99 19.91,11.99 ANA_IN3.1 ; 3.57,5.88 ANA_IN2.1 ; 3.57,14.01 ANA_IN4.1
5V: length 145.9
  Top Layer w0.8: IIC2.1 10.18,18.24 9.27,17.33 9.27,14.41 11.18,12.5 ; MPU6500.1 6.75,58.35 MCUEsp32C3.5V ; v1(20.32,24.82) 20.36,24.82 IIC1.1 ; v1(14.48,12.5) 11.18,12.5 ; 11.18,12.5 9.29,10.62 UART1.1 6.56,7.42 v1(4.7,7.42)
  Bottom Layer w0.8: 14.41,12.45 16.11,14.15 19.05,14.15 19.93,15.03 U2.1 ; 14.41,12.45 15.98,10.88 UART2.1 15.98,3.25 16.38,2.85 21.59,2.85 22.1,3.36 22.1,24.82 ; 14.41,12.45 14.42,12.45 v1(14.48,12.5) ; 22.1,24.82 v1(20.32,24.82) ; 22.1,24.82 22.1,29.52 21.01,30.6 C1.2 18.15,30.62 R2.2 R1.2 9.95,30.54 2.16,30.54 0.7,32 0.7,55.37 1.63,56.3 MCUEsp32C3.5V ; v1(4.7,7.42) 4.66,7.42 Clamp.1
GND: length 20.3
  Top Layer w0.8: v1(6.22,10.45) 6.22,11.96 6.17,12.01 ; UART1.4 v1(12.29,8.06) ; 6.17,12.01 v1(8.89,12.01) ; 6.17,12.01 ANA_IN4.3
  Bottom Layer w0.8: UART2.4 12.98,7.37 v1(12.29,8.06) 10.67,8.06 8.89,9.84 v1(8.89,12.01) ; Clamp.4 v1(6.22,10.45)
  vias: v1(2.16,0.94) v1(3.94,16.82) v1(4.91,0.94) v1(5.59,28.76) v1(5.59,26) v1(5.59,22.53) v1(5.59,20.28) v1(6.22,31.93) v1(6.16,16.82) v1(7.87,8.31) v1(8.25,7.29) v1(8.64,32.95) v1(10.6,32.95) v1(12.06,14.66) v1(13.79,14.66) v1(17.78,9.45) v1(17.78,7.48) v1(19.43,0.69) v1(22.98,0.69) v1(23.88,20.63) v1(23.88,17.79)
ANA1: length 35.5
  Top Layer w0.254: v1(19.94,4.88) ANA_IN1.2
  Inner1 w0.254: v1(19.94,4.88) 20.7,4.88 20.96,5.14 20.96,33.2 23.3,35.55 MCUEsp32C3.P3
ANA2: length 52.6
  Top Layer w0.254: v1(5.08,4.88) ANA_IN2.2
  Inner1 w0.254: v1(5.08,4.88) 6.99,4.88 9.27,7.17 13.72,7.17 15.11,8.56 v1(15.11,40.44)
  Bottom Layer w0.254: v1(15.11,40.44) 16.51,41.84 22.52,41.84 MCUEsp32C3.P4
ANA3: length 40.7
  Top Layer w0.254: v1(19.94,13.01) ANA_IN3.2
  Inner1 w0.254: v1(19.94,13.01) 17.15,13.01 16.26,13.9 16.26,42.22 18.41,44.38 21.21,44.38 21.99,43.6 MCUEsp32C3.P5
ANA4: length 30.9
  Top Layer w0.254: ANA_IN4.2 6.6,13.01 7.37,13.77 7.37,38.39 MCUEsp32C3.P1
BTN1: length 27.9
  Bottom Layer w0.254: MCUEsp32C3.P6 21.54,44.38 12.57,44.38 6.99,38.79 6.99,34.6 5.21,32.82 3.47,32.82 BTN_1.1
BTN2: length 21.7
  Top Layer w0.254: MCUEsp32C3.P2 1.78,40.68 1.78,25.46 3.34,23.89 BTN_2.1
CLAMP_SCL: length 39.9
  Bottom Layer w0.254: U2.7 18.66,24.83 16.13,27.36 16.13,28.25 15.24,29.14 11.51,29.14 R1.1 8.68,27.66 7.37,26.34 7.37,12.88 6.35,11.87 3.81,11.87 2.67,10.72 2.67,8.95 3.18,8.44 4.63,8.44 Clamp.2
CLAMP_SDA: length 32.5
  Bottom Layer w0.254: U2.6 17.39,24.96 14.69,27.66 R2.1 12.15,26.47 8.64,26.47 8,25.84 8,10.72 6.72,9.45 Clamp.3
RX: length 59.2
  Top Layer w0.254: UART1.3 11.29,4.64 v1(11.3,4.63)
  Inner2 w0.254: 14.35,6.28 11.94,6.28 11.3,5.64 v1(11.3,4.63) ; 14.35,6.28 15.11,6.28 16,7.17 16,48.82 19.18,52 21.54,52 MCUEsp32C3.P9 ; 14.35,6.28 13.97,5.9 v1(13.97,4.75)
  Bottom Layer w0.254: UART2.3 13.97,4.7 v1(13.97,4.75)
SCL: length 49.6
  Top Layer w0.254: 18.94,25.84 v1(19.81,25.84) IIC1.2 ; 18.94,25.84 18.92,25.83 v1(18.92,19.23) ; 18.94,25.84 17.9,25.84 17.02,26.73 17.02,49.84 MPU6500.3 ; v1(14.1,19.23) 11.38,19.23 IIC2.2
  Bottom Layer w0.254: MPU6500.3 21.25,53.27 MCUEsp32C3.P8 ; v1(14.1,19.23) v1(18.92,19.23)
SDA: length 54.2
  Top Layer w0.254: 11.43,20.25 9.65,20.25 9.02,20.88 9.02,28.12 v1(10.41,29.52) ; MPU6500.4 17.91,48.19 17.91,27.87 18.93,26.84 v1(19.75,26.84) IIC1.3
  Bottom Layer w0.254: v1(10.41,29.52) 19.43,29.52 19.69,29.27 19.69,26.91 v1(19.75,26.84) ; MCUEsp32C3.P7 21.25,50.73 MPU6500.4
TX: length 62.8
  Top Layer w0.254: UART1.2 10.29,4.64 v1(10.29,4.63)
  Inner1 w0.254: 14.99,6.28 v1(14.99,4.63) ; 14.99,6.28 15.88,7.17 15.88,51.36 19.05,54.54 21.54,54.54 MCUEsp32C3.P10 ; 14.99,6.28 10.79,6.28 10.29,5.77 v1(10.29,4.63)
  Bottom Layer w0.254: v1(14.99,4.63) 14.99,4.68 UART2.2
$1N1241: length 9.8
  Top Layer w0.254: v1(18.66,17.3) 15.45,20.5 14.1,20.5 13.34,21.27 v1(13.34,24.06)
  Bottom Layer w0.254: v1(13.34,24.06) C2.2

## Copper pours and planes (outline as drawn; the poured copper is in the pictures)
GND on Top Layer: -2.03,61.4 26.54,61.4 26.54,-7.31 -2.03,-7.31
GND on Bottom Layer: -4.83,62.03 29.46,62.03 29.46,-7.56 -4.83,-7.56
GND on Inner1: -3.81,60.89 29.08,60.89 29.08,-3.25 -3.81,-3.25
GND on Inner2: -7.49,61.91 32.77,61.91 32.77,-3.88 -7.49,-3.88

Small or netless copper shapes (teardrops, artwork), in the pictures only: 33 on Top Layer, 30 on Bottom Layer, 10 on Inner1, 4 on Inner2
